# Altium project Brightside_Telemetry_rev2.PrjPcb (part 3 of 3)

## Sheet Brightside_Telemetry_stm_rev2.SchDoc
size A4
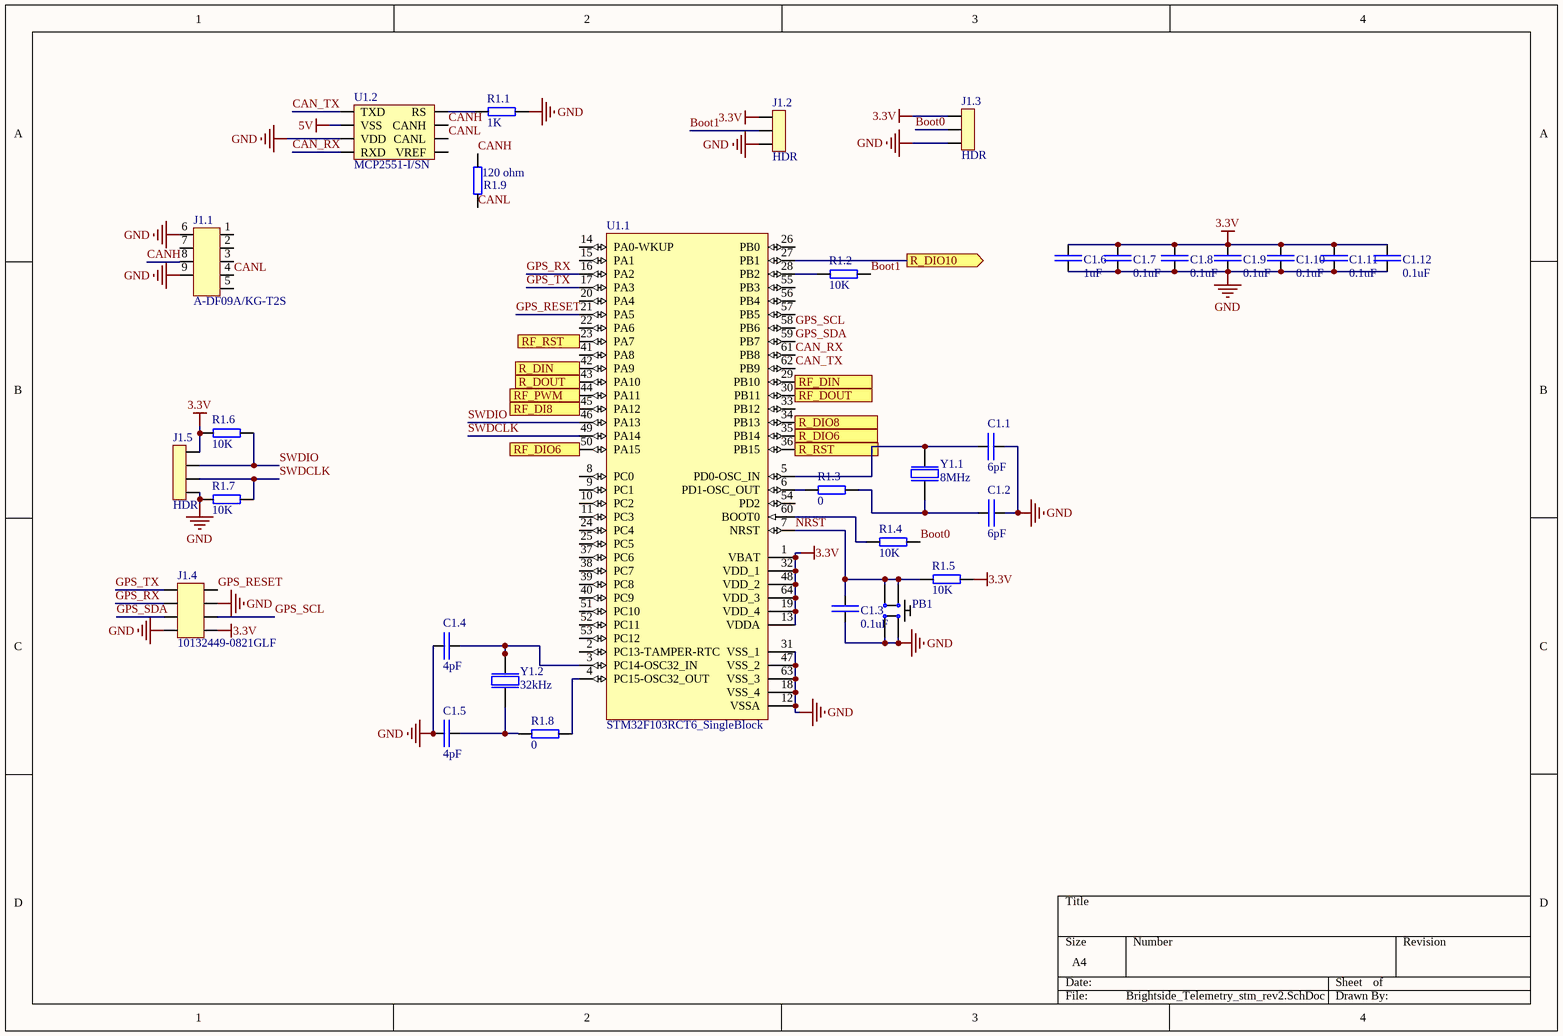
[diagram p2: Brightside_Telemetry_stm_rev2.SchDoc]

### Parts
C1.1  6pF  [0603]
C1.2  6pF  [0603]
C1.3  0.1uF  [C0805]
C1.4  4pF  [0603]
C1.5  4pF  [0603]
C1.6  1uF  [1206]
C1.7  0.1uF  [C0805]
C1.8  0.1uF  [C0805]
C1.9  0.1uF  [C0805]
C1.10  0.1uF  [C0805]
C1.11  0.1uF  [C0805]
C1.12  0.1uF  [C0805]
J1.1  A-DF09A/KG-T2S  [DB9 (Female)]
J1.2  HDR  [0.1" Header 3pos]
J1.3  HDR  [0.1" Header 3pos]
J1.4  10132449-0821GLF  [Micro-Fit 3.0 8pos]
J1.5  HDR  [0.1" Header 4pos]
PB1  P12961SCT-ND  [P12961SCT-ND]  (value not drawn)
R1.1  1K  [R0805]
R1.2  10K  [R0805]
R1.3  0  [0805]
R1.4  10K  [R0805]
R1.5  10K  [R0805]
R1.6  10K  [R0805]
R1.7  10K  [R0805]
R1.8  0  [0805]
R1.9  120 ohm  [R0805]
U1.1  STM32F103RCT6_SingleBlock  [64-LQFP]
U1.2  MCP2551-I/SN  [8-SOIC]
Y1.1  8MHz  [NX8045GB-8.000000MHZ]
Y1.2  32kHz  [FC-135 32.7680KA-AG]

### Ports
R_DIN (out), R_DIO6 (out), R_DIO8 (out), R_DIO10 (out), R_DOUT (out), R_RST (out), RF_DI8 (out), RF_DIN (out), RF_DIO6 (out), RF_DOUT (out), RF_PWM (out), RF_RST (out)

### Nets
3.3V: C1.6.1 C1.7.2 C1.8.2 C1.9.2 C1.10.2 C1.11.2 C1.12.2 J1.2.1 J1.3.1 J1.4.4 J1.5.4 R1.5.2 R1.6.1 U1.1.1(VBAT) U1.1.13(VDDA) U1.1.19(VDD_4) U1.1.32(VDD_1) U1.1.48(VDD_2) U1.1.64(VDD_3)
5V: U1.2.2(VSS)
GND: C1.1.2 C1.2.2 C1.3.1 C1.4.1 C1.5.1 C1.6.2 C1.7.1 C1.8.1 C1.9.1 C1.10.1 C1.11.1 C1.12.1 J1.1.6 J1.1.9 J1.2.3 J1.3.3 J1.4.2 J1.4.8 J1.5.1 PB1.2(A') PB1.4(B') R1.1.2 R1.7.1 U1.1.12(VSSA) U1.1.18(VSS_4) U1.1.31(VSS_1) U1.1.47(VSS_2) U1.1.63(VSS_3) U1.2.3(VDD)
Boot0: J1.3.2 R1.4.2
Boot1: J1.2.2 R1.2.2
CAN_RX: U1.1.61(PB8) U1.2.4(RXD)
CAN_TX: U1.1.62(PB9) U1.2.1(TXD)
CANH: J1.1.8 R1.9.2 U1.2.7(CANH)
CANL: J1.1.4 R1.9.1 U1.2.6(CANL)
GPS_RESET: J1.4.1 U1.1.21(PA5)
GPS_RX: J1.4.6 U1.1.16(PA2)
GPS_SCL: J1.4.3 U1.1.58(PB6)
GPS_SDA: J1.4.7 U1.1.59(PB7)
GPS_TX: J1.4.5 U1.1.17(PA3)
NRST: C1.3.2 PB1.1(A) PB1.3(B) R1.5.1 U1.1.7(NRST)
SWDCLK: J1.5.2 R1.7.2 U1.1.49(PA14)
SWDIO: J1.5.3 R1.6.2 U1.1.46(PA13)
NetC1.1_1: C1.1.1 U1.1.5(PD0-OSC_IN) Y1.1.2
NetC1.2_1: C1.2.1 R1.3.2 Y1.1.1
NetC1.4_2: C1.4.2 U1.1.3(PC14-OSC32_IN) Y1.2.1
NetC1.5_2: C1.5.2 R1.8.1 Y1.2.2
NetC2.12_1: U1.1.23(PA7) ; port RF_RST
NetC2.13_2: U1.1.36(PB15) ; port R_RST
NetR1.1_1: R1.1.1 U1.2.8(RS)
NetR1.2_1: R1.2.1 U1.1.28(PB2)
NetR1.3_1: R1.3.1 U1.1.6(PD1-OSC_OUT)
NetR1.4_1: R1.4.1 U1.1.60(BOOT0)
NetR1.8_2: R1.8.2 U1.1.4(PC15-OSC32_OUT)
NetR2.2_1: U1.1.42(PA9) ; port R_DIN
NetU1.1_27: U1.1.27(PB1) ; port R_DIO10
NetU1.1_29: U1.1.29(PB10) ; port RF_DIN
NetU1.1_30: U1.1.30(PB11) ; port RF_DOUT
NetU1.1_34: U1.1.34(PB13) ; port R_DIO8
NetU1.1_35: U1.1.35(PB14) ; port R_DIO6
NetU1.1_43: U1.1.43(PA10) ; port R_DOUT
NetU1.1_44: U1.1.44(PA11) ; port RF_PWM
NetU1.1_45: U1.1.45(PA12) ; port RF_DI8
NetU1.1_50: U1.1.50(PA15) ; port RF_DIO6

Not connected (* = marked no-connect by the designer): J1.1 1 2 3 5 7; U1.1 2(PC13-TAMPER-RTC) 8(PC0) 9(PC1) 10(PC2) 11(PC3) 14(PA0-WKUP) 15(PA1) 20(PA4) 22(PA6) 24(PC4) 25(PC5) 26(PB0) 33(PB12) 37(PC6) 38(PC7) 39(PC8) 40(PC9) 41(PA8) 51(PC10) 52(PC11) 53(PC12) 54(PD2) 55(PB3) 56(PB4) 57(PB5); U1.2 5(VREF)

### Library data of the parts
C1.1 C1.2 = CC0603DRNPO9BN6R0: CAP CER 6PF 50V C0G/NPO 0603; Manufacturer: Yageo; Dielectric: C0G; Supplier 1: Digi-Key; Supplier Part Number 1: 311-1055-1-ND; Manufacturer Part Number: CC0603DRNPO9BN6R0; RoHS: Yes; Category: Ceramic Capacitors; Stock 1: 25117; Mount: Surface Mount; Case/Package: 0603; Weight: 7.1E-05oz; Case Code (Imperial): 0603; Case Code (Metric): 1608; Min Operating Temperature: -55°C; Max Operating Temperature: 125°C; Capacitance: 6pF; Packaging: Tape and Reel; Voltage Rating: 50V; Voltage Rating (DC): 50V; Package Quantity: 1; Termination: SMD/SMT; Composition: Ceramic; Length: 1.6mm; Width: 0.8mm; Thickness: 0.035inch; Depth: 0.8mm; Lead Free: Lead Free; ComponentLink1URL: https://datasheet.ciiva.com/145/mlccorderingcode-145158.pdf?src-supplier=Digi-Key; ComponentLink1Description: https://datasheet.ciiva.com/145/mlccorderingcode-145158.pdf?src-supplier=Digi-Key; ComponentLink2URL: https://datasheet.ciiva.com/145/mlccorderingcode-145159.pdf?src-supplier=Digi-Key; ComponentLink2Description: https://datasheet.ciiva.com/145/mlccorderingcode-145159.pdf?src-supplier=Digi-Key; ComponentLink3URL: https://datasheet.ciiva.com/145/mlccorderingcode-145160.pdf?src-supplier=Digi-Key; ComponentLink3Description: https://datasheet.ciiva.com/145/mlccorderingcode-145160.pdf?src-supplier=Digi-Key
C1.3 C1.7-C1.12 = CL21B104KBCWPNC: CAP CER 0.1UF 50V X7R 0805; Manufacturer: Samsung; Capacitance: 100nF; Tolerance: 10%; Supplier 1: Digi-Key; Supplier Part Number 1: 1276-6557-1-ND; Manufacturer Part Number: CL21B104KBCWPNC; Stock 1: 6545; Pricing 1: 1 = 0.10000, 10 = 0.06700, 100 = 0.02990, 500 = 0.02138, 1000 = 0.01680 (USD); RoHS: Yes; Mount: Surface Mount; Case/Package: 0805; Case Code (Metric): 2012; Case Code (Imperial): 0805; Min Operating Temperature: -55°C; Max Operating Temperature: 125°C; Packaging: Tape and Reel; Voltage Rating: 50V; Features: Soft Termination; Length: 0.079inch; Width: 0.049inch; Thickness: 0.053inch; Ratings: AEC-Q200; Category: Capacitors
C1.4 C1.5 = CC0603CRNPO9BN4R0: CAP CER 4PF 50V C0G/NPO 0603; Manufacturer: Yageo; Dielectric: C0G; Insulation Resistance: 10GR; Supplier 1: Digi-Key; Supplier Part Number 1: 311-1053-1-ND; Manufacturer Part Number: CC0603CRNPO9BN4R0; RoHS: Yes; Category: Ceramic Capacitors; Stock 1: 1954; Mount: Surface Mount; Case/Package: 0603; Number of Pins: 2; Weight: 7.1E-05oz; Case Code (Imperial): 0603; Case Code (Metric): 1608; Min Operating Temperature: -55°C; Max Operating Temperature: 125°C; Termination: SMD/SMT; Composition: Ceramic; Capacitance: 4pF; Packaging: Tape and Reel; Voltage Rating: 50V; Voltage Rating (DC): 50V; Package Quantity: 1; Length: 1.6mm; Thickness: 0.035inch; Depth: 0.8mm; Width: 0.8mm; Lead Free: Lead Free; ComponentLink1URL: https://datasheet.ciiva.com/145/mlccorderingcode-145161.pdf?src-supplier=Digi-Key; ComponentLink1Description: https://datasheet.ciiva.com/145/mlccorderingcode-145161.pdf?src-supplier=Digi-Key; ComponentLink2URL: https://datasheet.ciiva.com/145/mlccorderingcode-145162.pdf?src-supplier=Digi-Key; ComponentLink2Description: https://datasheet.ciiva.com/145/mlccorderingcode-145162.pdf?src-supplier=Digi-Key; ComponentLink3URL: https://datasheet.ciiva.com/145/mlccorderingcode-145163.pdf?src-supplier=Digi-Key; ComponentLink3Description: https://datasheet.ciiva.com/145/mlccorderingcode-145163.pdf?src-supplier=Digi-Key
C1.6 = 885012208036: CAP CER 1UF 16V X7R 1206; Manufacturer: Wurth Electronics; Tolerance: 10%; Supplier 1: Digi-Key; Supplier Part Number 1: 732-7692-1-ND; Manufacturer Part Number: 885012208036; RoHS: Yes; Category: Ceramic Capacitors; Stock 1: 2993; Mount: Surface Mount; Case/Package: 1206; Case Code (Imperial): 1206; Case Code (Metric): 3216; Min Operating Temperature: -55°C; Max Operating Temperature: 125°C; Packaging: Tape and Reel; Capacitance: 1uF; Voltage Rating: 16V; Length: 0.126inch; Width: 0.063inch; Thickness: 0.051inch; ComponentLink1URL: http://katalog.we-online.de/pbs/datasheet/885012208036.pdf?src-supplier=Digi-Key; ComponentLink1Description: http://katalog.we-online.de/pbs/datasheet/885012208036.pdf?src-supplier=Digi-Key; ComponentLink2URL: https://katalog.we-online.de/pbs/datasheet/885012208036.pdf?src-supplier=Digi-Key; ComponentLink2Description: https://katalog.we-online.de/pbs/datasheet/885012208036.pdf?src-supplier=Digi-Key
J1.1 = A-DF09A/KG-T2S: FEMALE DB9 D-SUBMINIATURE CONNECTOR, CURRENT RATING 3A, VOLTAGE RATING 250VAC; Manufacturer: Assmann; Connector Type: D-Sub,Receptacle,Signal; Number of Positions: 9; Max Supply Voltage (AC): 250V; Number of Ports: 1; Supplier 1: Digi-Key; Supplier Part Number 1: AE10921-ND; Manufacturer Part Number: A-DF09A/KG-T2S; RoHS: Yes; Category: D-Sub Connectors; Stock 1: 18258; Mount: Through Hole; Housing Material: PBT; Color: Black; Contact Plating: Gold; Contact Material: Brass; Number of Terminals: 9; Min Operating Temperature: -55°C; Max Operating Temperature: 125°C; Package Quantity: 90; Packaging: Tray; Number of Rows: 2; Current Rating: 3A; Termination: Solder; Orientation: Right Angle; Length: 30.81mm; Depth: 18.6mm; Radiation Hardening: No; Lead Free: Lead Free; ComponentLink1URL: https://datasheet.ciiva.com/26927/getdatasheetpartid-755627-26927441.pdf?src-supplier=Verical; ComponentLink1Description: https://datasheet.ciiva.com/26927/getdatasheetpartid-755627-26927441.pdf?src-supplier=Verical
J1.2 J1.3 = 0.1" Header 3pos
J1.4 = 10132449-0821GLF: Micro-fit 3.0 8pos right-angle; Manufacturer: Molex; Manufacturer Part Number: 43045-0800; Number of Positions: 8; Contact Resistance: 10mR; Gender: Male; Working Voltage: 250V; Max Voltage Rating (DC): 250.25kV; Current Rating: 5A; Voltage Rating: 600V; Insulation Resistance: 1GR; Pitch: 3mm; Approvals: UL,CSA,TUV; Glow Wire Compliant: Compliant; Supplier 1: Digi-Key; Supplier Part Number 1: WM1816-ND; RoHS: Yes; Category: Headers and Wire Housings; Stock 1: 7880; Mount: Through Hole; Case/Package: SMC; Housing Color: Black; Housing Material: Thermoplastic; Contact Plating: Tin; Contact Material: Brass,Tin; Color: Black; Material: Polyester; Min Operating Temperature: -40°C; Max Operating Temperature: 105°C; Termination: Solder; Number of Contacts: 8; Orientation: Right Angle; Number of Rows: 2; Packaging: Tray; Number of Circuits: 8; Number of Poles: 8; Voltage Rating (AC): 250V; Package Quantity: 1440; Max Current Rating: 5A; Voltage Rating (DC): 250V; Diameter: 3mm; Length: 16.15mm; Height: 8.77mm; Row Spacing: 3mm; Depth: 12.2mm; Radiation Hardening: No; Flammability Rating: UL94 V-0; REACH SVHC: Unknown; Halogen Free: Low Halogen; Lead Free: Lead Free; ComponentLink1URL: https://datasheet.ciiva.com/5158/0430450800-pcb-headers-142625-5158817.pdf?src-supplier=Mouser; ComponentLink1Description: https://datasheet.ciiva.com/5158/0430450800-pcb-headers-142625-5158817.pdf?src-supplier=Mouser; ComponentLink2URL: https://datasheet.ciiva.com/7683/27645-7683683.pdf?src-supplier=Element14; ComponentLink2Description: https://datasheet.ciiva.com/7683/27645-7683683.pdf?src-supplier=Element14; ComponentLink3URL: https://datasheet.ciiva.com/11751/0900766b80027348-11751142.pdf?src-supplier=RSComponents; ComponentLink3Description: https://datasheet.ciiva.com/11751/0900766b80027348-11751142.pdf?src-supplier=RSComponents; ComponentLink4URL: https://datasheet.ciiva.com/30198/267770430450800-pcb-headers-30198875.pdf?src-supplier=Onlinecomponents.com; ComponentLink4Description: https://datasheet.ciiva.com/30198/267770430450800-pcb-headers-30198875.pdf?src-supplier=Onlinecomponents.com; ComponentLink5URL: https://datasheet.ciiva.com/19462/883536-19462164.pdf?src-supplier=Jameco; ComponentLink5Description: https://datasheet.ciiva.com/19462/883536-19462164.pdf?src-supplier=Jameco; ComponentLink6URL: https://datasheet.ciiva.com/14155/04402310-14155206.pdf?src-supplier=Distrelec; ComponentLink6Description: https://datasheet.ciiva.com/14155/04402310-14155206.pdf?src-supplier=Distrelec; ComponentLink7URL: https://datasheet.ciiva.com/16657/0430450800-pcb-headers-16657964.pdf?src-supplier=Avnet+Europe; ComponentLink7Description: https://datasheet.ciiva.com/16657/0430450800-pcb-headers-16657964.pdf?src-supplier=Avnet+Europe; ComponentLink8URL: https://datasheet.ciiva.com/10087/0430450800-pcb-headers-10087853.pdf?src-supplier=Avnet; ComponentLink8Description: https://datasheet.ciiva.com/10087/0430450800-pcb-headers-10087853.pdf?src-supplier=Avnet; ComponentLink9URL: https://datasheet.ciiva.com/1443/1850016-1443537.pdf?src-supplier=Element14; ComponentLink9Description: https://datasheet.ciiva.com/1443/1850016-1443537.pdf?src-supplier=Element14
J1.5 = 0.1" Header 4pos
PB1 = P12961SCT-ND: SWITCH TACTILE SPST-NO 0.02A 15V; Manufacturer 1: Panasonic; Manufacturer Part Number 1: EVQ-Q2Y03W; Mechanical Life: 100000Cycles; Operating Force: 3.5N; Contact Current Rating: 20mA; Contact Resistance: 100mR; Number of Poles: 1; Voltage Rating (AC): 250V; Throw Configuration: SPST; Illumination Type: Non-Illuminated,Illuminated; Switch Travel: 0.25mm; Switch Function: Off-Mom; Actuator Type: Standard; Actuator Length: 1.3mm; Supplier 1: Digi-Key; Stock 1: 209620; Pricing 1: 1=0.30000, 10=0.28600, 25=0.27520, 50=0.26520, 100=0.25490, 250=0.23452, 500=0.20394, 1000=0.17335 (USD); RoHS: Yes; Mount: Surface Mount; Case/Package: SMD/SMT; Color: White; Min Operating Temperature: -40°C; Max Operating Temperature: 85°C; Current Rating: 20mA; Voltage Rating (DC): 15V; Packaging: Tape and Reel; Package Quantity: 1; Max Current Rating: 20mA; Max Voltage Rating (DC): 15V; Termination: SMD/SMT; Electrical Life: 100000Cycles; Orientation: Straight; Length: 6mm; Height: 3.1mm; Width: 6mm; Depth: 6.6mm; Thickness: 1.8mm; Radiation Hardening: No; REACH SVHC: Unknown; Lead Free: Lead Free; ComponentLink1URL: https://datasheet.ciiva.com/25603/0900766b810ad3e5-25603840.pdf?src-supplier=RSComponents; ComponentLink1Description: https://datasheet.ciiva.com/25603/0900766b810ad3e5-25603840.pdf?src-supplier=RSComponents; ComponentLink2URL: https://datasheet.ciiva.com/2901/atk0000ce28-2901284.pdf?src-supplier=Digi-Key; ComponentLink2Description: https://datasheet.ciiva.com/2901/atk0000ce28-2901284.pdf?src-supplier=Digi-Key; ComponentLink3URL: https://datasheet.ciiva.com/2901/atk0000ce28-2901285.pdf?src-supplier=Digi-Key; ComponentLink3Description: https://datasheet.ciiva.com/2901/atk0000ce28-2901285.pdf?src-supplier=Digi-Key; ComponentLink4URL: https://datasheet.ciiva.com/2901/atk0000ce28-2901286.pdf?src-supplier=Digi-Key; ComponentLink4Description: https://datasheet.ciiva.com/2901/atk0000ce28-2901286.pdf?src-supplier=Digi-Key; ComponentLink5URL: https://datasheet.ciiva.com/30127/8atk0000ce28-30127814.pdf?src-supplier=Onlinecomponents.com; ComponentLink5Description: https://datasheet.ciiva.com/30127/8atk0000ce28-30127814.pdf?src-supplier=Onlinecomponents.com; ComponentLink6URL: https://datasheet.ciiva.com/8165/atk0000ce28-8165191.pdf?src-supplier=Avnet; ComponentLink6Description: https://datasheet.ciiva.com/8165/atk0000ce28-8165191.pdf?src-supplier=Avnet; ComponentLink7URL: https://datasheet.ciiva.com/17099/70270561-17099386.pdf?src-supplier=Allied+Electronics; ComponentLink7Description: https://datasheet.ciiva.com/17099/70270561-17099386.pdf?src-supplier=Allied+Electronics; ComponentLink8URL: https://datasheet.ciiva.com/5685/28111-5685339.pdf?src-supplier=Farnell; ComponentLink8Description: https://datasheet.ciiva.com/5685/28111-5685339.pdf?src-supplier=Farnell; ComponentLink9URL: https://datasheet.ciiva.com/16438/atk0000ce28-16438079.pdf?src-supplier=Future+Electronics; ComponentLink9Description: https://datasheet.ciiva.com/16438/atk0000ce28-16438079.pdf?src-supplier=Future+Electronics; Supplier Part Number 1: P12961SDKR-ND
R1.1 = ERJ6ENF1001V: RES SMD 1K OHM 1% 1/8W 0805; Manufacturer: Panasonic; Resistance: 1kR; Power Rating: 125mW; Temperature Coefficient: 100ppm/°C; Voltage Rating (DC): 150V; Supplier 1: Digi-Key; Supplier Part Number 1: P1.00KCCT-ND; Manufacturer Part Number: ERJ6ENF1001V; Stock 1: 946321; Pricing 1: 1 = 0.100000, 10 = 0.081000, 100 = 0.031100, 1000 = 0.013670, 2500 = 0.011810 (USD); RoHS: Yes; Mount: Surface Mount; Case/Package: 0805; Number of Pins: 2; Case Code (Metric): 2012; Case Code (Imperial): 0805; Contact Plating: Tin; Min Operating Temperature: -55°C; Max Operating Temperature: 155°C; Tolerance: 1%; Packaging: Tape and Reel; Number of Terminations: 2; Package Quantity: 1; Voltage Rating: 150V; Composition: Thick Film; Termination: SMD/SMT; Military Standard: Not; Max Power Dissipation: 125mW; Features: Automotive AEC-Q200; Length: 2mm; Height: 0.6mm; Width: 0.049inch; Depth: 1.25mm; Radiation Hardening: No; REACH SVHC: No SVHC; Lead Free: Lead Free; ComponentLink1URL: https://datasheet.ciiva.com/34303/1988962-34303619.pdf?src-supplier=Jameco; ComponentLink1Description: https://datasheet.ciiva.com/34303/1988962-34303619.pdf?src-supplier=Jameco; ComponentLink2URL: https://datasheet.ciiva.com/11808/0900766b80f80784-11808500.pdf?src-supplier=RSComponents; ComponentLink2Description: https://datasheet.ciiva.com/11808/0900766b80f80784-11808500.pdf?src-supplier=RSComponents; ComponentLink3URL: https://datasheet.ciiva.com/28532/426256-28532134.pdf?src-supplier=Element14; ComponentLink3Description: https://datasheet.ciiva.com/28532/426256-28532134.pdf?src-supplier=Element14; ComponentLink4URL: https://datasheet.ciiva.com/30051/aoa0000ce2-30051974.pdf?src-supplier=Onlinecomponents.com; ComponentLink4Description: https://datasheet.ciiva.com/30051/aoa0000ce2-30051974.pdf?src-supplier=Onlinecomponents.com; ComponentLink5URL: https://datasheet.ciiva.com/16774/70260748-16774249.pdf?src-supplier=Allied+Electronics; ComponentLink5Description: https://datasheet.ciiva.com/16774/70260748-16774249.pdf?src-supplier=Allied+Electronics; ComponentLink6URL: https://datasheet.ciiva.com/46373/1678782-46373337.pdf?src-supplier=Element14; ComponentLink6Description: https://datasheet.ciiva.com/46373/1678782-46373337.pdf?src-supplier=Element14; ComponentLink7URL: https://datasheet.ciiva.com/46373/1678782-46373338.pdf?src-supplier=Element14; ComponentLink7Description: https://datasheet.ciiva.com/46373/1678782-46373338.pdf?src-supplier=Element14; ComponentLink8URL: https://datasheet.ciiva.com/48532/aoa0000ce2-48532156.pdf?src-supplier=Avnet; ComponentLink8Description: https://datasheet.ciiva.com/48532/aoa0000ce2-48532156.pdf?src-supplier=Avnet; ComponentLink9URL: https://datasheet.ciiva.com/7942/426256-7942429.pdf?src-supplier=Element14; ComponentLink9Description: https://datasheet.ciiva.com/7942/426256-7942429.pdf?src-supplier=Element14; ComponentLink10URL: https://datasheet.ciiva.com/16199/aoa0000ce2-16199262.pdf?src-supplier=Future+Electronics; ComponentLink10Description: https://datasheet.ciiva.com/16199/aoa0000ce2-16199262.pdf?src-supplier=Future+Electronics; ComponentLink11URL: https://datasheet.ciiva.com/9117/aoa0000ce2-9117391.pdf?src-supplier=Avnet; ComponentLink11Description: https://datasheet.ciiva.com/9117/aoa0000ce2-9117391.pdf?src-supplier=Avnet; ComponentLink12URL: https://datasheet.ciiva.com/16523/aoa0000ce2-16523855.pdf?src-supplier=Avnet+Asia; ComponentLink12Description: https://datasheet.ciiva.com/16523/aoa0000ce2-16523855.pdf?src-supplier=Avnet+Asia; Category: Resistors
R1.2 R1.4-R1.7 = ERJ6ENF1002V: RES SMD 10K OHM 1% 1/8W 0805; Manufacturer: Yageo; Manufacturer Part Number: ERJ-6ENF1002V; Temperature Coefficient: 100ppm/°C; Voltage Rating (DC): 150V; Power Rating: 125mW; Resistance: 10000R; Supplier 1: Digi-Key; Supplier Part Number 1: P10.0KCCT-ND; Stock 1: 3342401; Pricing 1: 1 = 0.100000, 10 = 0.081000, 100 = 0.031100, 1000 = 0.013670, 2500 = 0.011810 (USD); RoHS: No; Mount: Surface Mount; Case/Package: 0805; Number of Pins: 2; Min Operating Temperature: -55°C; Max Operating Temperature: 155°C; Packaging: Tape and Reel; Tolerance: 1%; Length: 2mm; Height: 0.5mm; Depth: 1.25mm; Width: 1.25mm; REACH SVHC: No SVHC; Lead Free: Lead Free; ComponentLink1URL: https://datasheet.ciiva.com/27056/2078477-27056611.pdf?src-supplier=Jameco; ComponentLink1Description: https://datasheet.ciiva.com/27056/2078477-27056611.pdf?src-supplier=Jameco; Category: Resistors
R1.3 R1.8 = RMCF0805ZT0R00: STACKPOLE ELECTRONICS - RMCF0805ZT0R00. - RES THKFLM 0805 0 OHM JUMPER 1/8W 200PPM/ C SMD ROHS COMPLIANT: YES; Resistance: 0mR; Power Rating: 125mW; Supplier 1: Digi-Key; Supplier Part Number 1: RMCF0805ZT0R00CT-ND; Manufacturer: Stackpole Electronics; Manufacturer Part Number: RMCF0805ZT0R00; RoHS: Yes; Category: Chip SMD Resistors; Stock 1: 14305; Mount: Surface Mount; Case/Package: 0805; Case Code (Metric): 2012; Case Code (Imperial): 0805; Contact Plating: Tin,Matte; Min Operating Temperature: -55°C; Max Operating Temperature: 155°C; Packaging: Tape and Reel; Features: Automotive AEC-Q200; Composition: Thick Film; Number of Terminations: 2; Military Standard: Not; Max Power Dissipation: 125mW; Length: 2mm; Height: 0.026inch; Width: 0.049inch; Depth: 1.25mm; Radiation Hardening: No; Lead Free: Lead Free; ComponentLink1URL: https://datasheet.ciiva.com/15193/getdatasheetpartid-360417-15193658.pdf?src-supplier=Verical; ComponentLink1Description: https://datasheet.ciiva.com/15193/getdatasheetpartid-360417-15193658.pdf?src-supplier=Verical
R1.9 = ERJ6ENV1200V: RES SMD 120 OHM 1% 1/8W 0805; ComponentLink1Description: https://datasheet.ciiva.com/11821/0900766b80f80784-11821533.pdf?src-supplier=RSComponents; ComponentLink1URL: https://datasheet.ciiva.com/11821/0900766b80f80784-11821533.pdf?src-supplier=RSComponents; Supplier 1: Digi-Key; Supplier Part Number 1: P120CCT-ND
U1.1 = STM32F103RCT6_SingleBlock: ARM® Cortex®-M3 STM32F1 Microcontroller IC 32-Bit 72MHz 256KB (256K x 8) FLASH; Supplier 1: Digi-Key; Supplier Part Number 1: 497-8920-ND
U1.2 = MCP2551-I/SN: CAN TRANSCEIVER; Manufacturer: Microchip; Body Material: Steel; Number of Contacts: 9; Current Rating: 5A; Gender: Male; Connector Type: D-Sub,Plug,Signal; Voltage Rating: 125V; Pitch: 2.84mm; Max Supply Voltage: 5.5V; Min Supply Voltage: 2.7V; Interface: SPI; Max Frequency: 400kHz; Access Time: 900ns; Density: 256Kb; Operating Supply Voltage: 5V; Frequency: 1MHz; Nominal Supply Current: 2.5mA; Memory Type: EEPROM; Contact Resistance: 10mR; Voltage Rating (AC): 250V; Number of Circuits: 2; Insulation Resistance: 1GR; Glow Wire Compliant: Compliant; Row Spacing: 0.1inch; Frequency Stability: 30ppm; Load Capacitance: 18pF; ESR (Equivalent Series Resistance): 140R; Frequency Tolerance: 20ppm; Series Resistance: 500R; Supplier 1: Digi-Key; Supplier Part Number 1: MCP2551-I/SN-ND; Manufacturer Part Number: MCP2551-I/SN; RoHS: Yes; Category: Interface ICs; Stock 1: 3363; ComponentLink1URL: https://datasheet.ciiva.com/8084/jp011797-8084592.pdf?src-supplier=Avnet; ComponentLink1Description: https://datasheet.ciiva.com/8084/jp011797-8084592.pdf?src-supplier=Avnet; ComponentLink2URL: https://datasheet.ciiva.com/27056/2040583-27056423.pdf?src-supplier=Jameco; ComponentLink2Description: https://datasheet.ciiva.com/27056/2040583-27056423.pdf?src-supplier=Jameco; ComponentLink3URL: https://datasheet.ciiva.com/1495/21667f-1495089.pdf?src-supplier=Element14; ComponentLink3Description: https://datasheet.ciiva.com/1495/21667f-1495089.pdf?src-supplier=Element14; ComponentLink4URL: https://datasheet.ciiva.com/1700/21667f-1700023.pdf?src-supplier=Digi-Key; ComponentLink4Description: https://datasheet.ciiva.com/1700/21667f-1700023.pdf?src-supplier=Digi-Key; ComponentLink5URL: https://datasheet.ciiva.com/14152/eb644223-644224-e-14152540.pdf?src-supplier=Distrelec; ComponentLink5Description: https://datasheet.ciiva.com/14152/eb644223-644224-e-14152540.pdf?src-supplier=Distrelec; ComponentLink6URL: https://datasheet.ciiva.com/17649/jp011797-17649039.pdf?src-supplier=Avnet+Europe; ComponentLink6Description: https://datasheet.ciiva.com/17649/jp011797-17649039.pdf?src-supplier=Avnet+Europe; Supplier 2: Digi-Key; Supplier Part Number 2: 9209ME-ND; Stock 2: 10320; Mount: Through Hole; Contact Plating: Gold; Contact Material: Brass; Housing Material: Nylon; Color: Black; Material: Metal; Housing Color: Black; Min Operating Temperature: -50°C; Max Operating Temperature: 100°C; Package Quantity: 80; Packaging: Tray; Termination: Through Hole; Number of Rows: 2; Number of Positions: 9; Length: 30.8mm; Height: 9.93mm; Width: 12.6mm; REACH SVHC: No SVHC; Lead Free: Lead Free; Flammability Rating: UL94 V-0; ComponentLink7URL: https://datasheet.ciiva.com/655/171-yyy-113ryy1-655574.pdf?src-supplier=Digi-Key; ComponentLink7Description: https://datasheet.ciiva.com/655/171-yyy-113ryy1-655574.pdf?src-supplier=Digi-Key; ComponentLink8URL: https://datasheet.ciiva.com/5118/171-yyy-113ryy1-5118968.pdf?src-supplier=Mouser; ComponentLink8Description: https://datasheet.ciiva.com/5118/171-yyy-113ryy1-5118968.pdf?src-supplier=Mouser; ComponentLink9URL: https://datasheet.ciiva.com/16376/171-yyy-113ryy1-16376504.pdf?src-supplier=Future+Electronics; ComponentLink9Description: https://datasheet.ciiva.com/16376/171-yyy-113ryy1-16376504.pdf?src-supplier=Future+Electronics; Supplier 3: Digi-Key; Supplier Part Number 3: 732-618009231121-ND; Stock 3: 281; Orientation: Right Angle; Depth: 18.5mm; ComponentLink10URL: https://datasheet.ciiva.com/12669/6180xx231121-12669218.pdf?src-supplier=Mouser; ComponentLink10Description: https://datasheet.ciiva.com/12669/6180xx231121-12669218.pdf?src-supplier=Mouser; ComponentLink11URL: https://datasheet.ciiva.com/1426/1442189-1426428.pdf?src-supplier=Element14; ComponentLink11Description: https://datasheet.ciiva.com/1426/1442189-1426428.pdf?src-supplier=Element14; Supplier 4: Digi-Key; Supplier Part Number 4: 732-618009231221-ND; Stock 4: 49; ComponentLink12URL: https://datasheet.ciiva.com/12669/6180xx231221-12669204.pdf?src-supplier=Mouser; ComponentLink12Description: https://datasheet.ciiva.com/12669/6180xx231221-12669204.pdf?src-supplier=Mouser; ComponentLink13URL: https://datasheet.ciiva.com/25605/0900766b81191766-25605476.pdf?src-supplier=RSComponents; ComponentLink13Description: https://datasheet.ciiva.com/25605/0900766b81191766-25605476.pdf?src-supplier=RSComponents; ComponentLink14URL: https://datasheet.ciiva.com/1426/1442191-1426429.pdf?src-supplier=Element14; ComponentLink14Description: https://datasheet.ciiva.com/1426/1442191-1426429.pdf?src-supplier=Element14; Supplier 5: Digi-Key; Supplier Part Number 5: LTC6820IMS#PBF-ND; Stock 5: 4671; Case/Package: MSOP; Number of Pins: 16; ComponentLink15URL: https://datasheet.ciiva.com/22649/1730562-22649446.pdf?src-supplier=Element14; ComponentLink15Description: https://datasheet.ciiva.com/22649/1730562-22649446.pdf?src-supplier=Element14; ComponentLink16URL: https://datasheet.ciiva.com/22767/1730562-22767677.pdf?src-supplier=Farnell; ComponentLink16Description: https://datasheet.ciiva.com/22767/1730562-22767677.pdf?src-supplier=Farnell; Supplier 6: Digi-Key; Supplier Part Number 6: 497-6348-1-ND; Stock 6: 4627; Memory Size: 256Kb; Radiation Hardening: No; ComponentLink17URL: https://datasheet.ciiva.com/15123/getdatasheetpartid-309492-15123357.pdf?src-supplier=Verical; ComponentLink17Description: https://datasheet.ciiva.com/15123/getdatasheetpartid-309492-15123357.pdf?src-supplier=Verical; ComponentLink18URL: https://datasheet.ciiva.com/41455/001185584-da-01-en-ic-eepr-256kbi-m24256-brmn6tp-soic-8-stm-41455201.pdf?src-supplier=Conrad; ComponentLink18Description: https://datasheet.ciiva.com/41455/001185584-da-01-en-ic-eepr-256kbi-m24256-brmn6tp-soic-8-stm-41455201.pdf?src-supplier=Conrad; ComponentLink19URL: https://datasheet.ciiva.com/1905/cd00001891-1905179.pdf?src-supplier=Digi-Key; ComponentLink19Description: https://datasheet.ciiva.com/1905/cd00001891-1905179.pdf?src-supplier=Digi-Key; ComponentLink20URL: https://datasheet.ciiva.com/1905/cd00001891-1905180.pdf?src-supplier=Digi-Key; ComponentLink20Description: https://datasheet.ciiva.com/1905/cd00001891-1905180.pdf?src-supplier=Digi-Key; ComponentLink21URL: https://datasheet.ciiva.com/1905/cd00001891-1905181.pdf?src-supplier=Digi-Key; ComponentLink21Description: https://datasheet.ciiva.com/1905/cd00001891-1905181.pdf?src-supplier=Digi-Key; Supplier 7: Digi-Key; Supplier Part Number 7: WM1860-ND; Stock 7: 11258; Working Voltage: 250V; Voltage Rating (DC): 250V; Halogen Free: Low Halogen; ComponentLink22URL: https://datasheet.ciiva.com/14155/04402066-14155224.pdf?src-supplier=Distrelec; ComponentLink22Description: https://datasheet.ciiva.com/14155/04402066-14155224.pdf?src-supplier=Distrelec; ComponentLink23URL: https://datasheet.ciiva.com/5158/0436500200-pcb-headers-148844-5158523.pdf?src-supplier=Mouser; ComponentLink23Description: https://datasheet.ciiva.com/5158/0436500200-pcb-headers-148844-5158523.pdf?src-supplier=Mouser; ComponentLink24URL: https://datasheet.ciiva.com/11748/0900766b80d6135b-11748140.pdf?src-supplier=RSComponents; ComponentLink24Description: https://datasheet.ciiva.com/11748/0900766b80d6135b-11748140.pdf?src-supplier=RSComponents; ComponentLink25URL: https://datasheet.ciiva.com/22683/1709823-22683551.pdf?src-supplier=Element14; ComponentLink25Description: https://datasheet.ciiva.com/22683/1709823-22683551.pdf?src-supplier=Element14; ComponentLink26URL: https://datasheet.ciiva.com/30161/48630436500200-pcb-headers-30161343.pdf?src-supplier=Onlinecomponents.com; ComponentLink26Description: https://datasheet.ciiva.com/30161/48630436500200-pcb-headers-30161343.pdf?src-supplier=Onlinecomponents.com; ComponentLink27URL: https://datasheet.ciiva.com/9432/0436500200-pcb-headers-9432849.pdf?src-supplier=Avnet; ComponentLink27Description: https://datasheet.ciiva.com/9432/0436500200-pcb-headers-9432849.pdf?src-supplier=Avnet; ComponentLink28URL: https://datasheet.ciiva.com/16089/1029720436500200-pcb-headers-16089218.pdf?src-supplier=Onlinecomponents.com; ComponentLink28Description: https://datasheet.ciiva.com/16089/1029720436500200-pcb-headers-16089218.pdf?src-supplier=Onlinecomponents.com; ComponentLink29URL: https://datasheet.ciiva.com/7920/1839562-7920756.pdf?src-supplier=Element14; ComponentLink29Description: https://datasheet.ciiva.com/7920/1839562-7920756.pdf?src-supplier=Element14; ComponentLink30URL: https://datasheet.ciiva.com/19462/884053-19462312.pdf?src-supplier=Jameco; ComponentLink30Description: https://datasheet.ciiva.com/19462/884053-19462312.pdf?src-supplier=Jameco; ComponentLink31URL: https://datasheet.ciiva.com/16654/0436500200-pcb-headers-16654958.pdf?src-supplier=Avnet+Europe; ComponentLink31Description: https://datasheet.ciiva.com/16654/0436500200-pcb-headers-16654958.pdf?src-supplier=Avnet+Europe; Supplier 8: Digi-Key; Supplier Part Number 8: 1175-1623-ND; Stock 8: 21730; ComponentLink32URL: https://datasheet.ciiva.com/6904/3020-34-0300-00-6904731.pdf?src-supplier=Digi-Key; ComponentLink32Description: https://datasheet.ciiva.com/6904/3020-34-0300-00-6904731.pdf?src-supplier=Digi-Key; ComponentLink33URL: https://datasheet.ciiva.com/18485/3020-xx-0300-00-18485471.pdf?src-supplier=Digi-Key; ComponentLink33Description: https://datasheet.ciiva.com/18485/3020-xx-0300-00-18485471.pdf?src-supplier=Digi-Key; Supplier 9: Digi-Key; Supplier Part Number 9: 535-10630-1-ND; Stock 9: 68218; Composition: Ceramic; Tolerance: 20ppm; ComponentLink34URL: https://datasheet.ciiva.com/862/abm3-862465.pdf?src-supplier=Digi-Key; ComponentLink34Description: https://datasheet.ciiva.com/862/abm3-862465.pdf?src-supplier=Digi-Key; Supplier 10: Digi-Key; Supplier Part Number 10: 535-9544-1-ND; Stock 10: 100673; ComponentLink35URL: https://datasheet.ciiva.com/855/abs07-855948.pdf?src-supplier=Digi-Key; ComponentLink35Description: https://datasheet.ciiva.com/855/abs07-855948.pdf?src-supplier=Digi-Key
Y1.1 = NX8045GB-8.000000MHZ: CRYSTAL 8.0000MHZ 8PF SMD; Manufacturer: NDK; ESR (Equivalent Series Resistance): 200R; Frequency Stability: 50ppm; Supplier 1: Digi-Key; Supplier Part Number 1: 644-1018-1-ND; Manufacturer Part Number: NX8045GB-8.000000MHZ; RoHS: Yes; Category: Crystals; Stock 1: 116457; Mount: Surface Mount; Case/Package: SMD/SMT; Number of Pins: 2; Min Operating Temperature: -10°C; Max Operating Temperature: 70°C; Packaging: Tape and Reel; Package Quantity: 1000; Frequency: 8MHz; Load Capacitance: 8pF; Frequency Tolerance: 50ppm; Length: 0.315inch; Height: 0.079inch; Width: 0.177inch; Lead Free: Exempt; ComponentLink1URL: https://datasheet.ciiva.com/856/nx8045gb-856752.pdf?src-supplier=Digi-Key; ComponentLink1Description: https://datasheet.ciiva.com/856/nx8045gb-856752.pdf?src-supplier=Digi-Key; ComponentLink2URL: https://datasheet.ciiva.com/856/nx8045gb-856753.pdf?src-supplier=Digi-Key; ComponentLink2Description: https://datasheet.ciiva.com/856/nx8045gb-856753.pdf?src-supplier=Digi-Key; ComponentLink3URL: https://datasheet.ciiva.com/856/nx8045gb-856754.pdf?src-supplier=Digi-Key; ComponentLink3Description: https://datasheet.ciiva.com/856/nx8045gb-856754.pdf?src-supplier=Digi-Key
Y1.2 = FC-13532.7680KA-AG0: Crystals 32.768KHz 20ppm 7.0pF -40C +85C; Manufacturer: Epson; Load Capacitance: 7pF; ESR (Equivalent Series Resistance): 65kR; Capacitance: 7E-12F; Supplier 1: Mouser; Supplier Part Number 1: 732-FC135-32.76KAAG0; Manufacturer Part Number: FC-13532.7680KA-AG0; RoHS: No; Category: Uncategorized; Weight: 0.000564oz; Min Operating Temperature: -40°C; Max Operating Temperature: 85°C; Frequency: 32.768kHz; Packaging: Tape and Reel; Tolerance: 20ppm; Package Quantity: 1000; Termination: SMD/SMT; Frequency Stability: 20ppm; Length: 3.2mm; Height: 0.8mm; Width: 1.5mm; ComponentLink1URL: http://www.mouser.com/ds/2/137/1699449-465441.pdf?src-supplier=Mouser; ComponentLink1Description: http://www.mouser.com/ds/2/137/1699449-465441.pdf?src-supplier=Mouser

## Sheet misc_comp.SchDoc
size A4
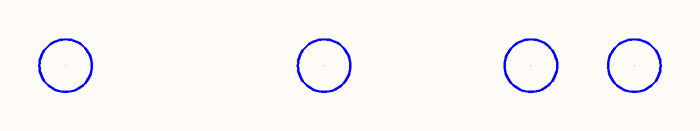
[diagram p3: misc_comp.SchDoc]

### Parts
M1  3mm Mounting Hole  [3mm Mounting Hole]  (value not drawn)
M2  3mm Mounting Hole  [3mm Mounting Hole]  (value not drawn)
M3  3mm Mounting Hole  [3mm Mounting Hole]  (value not drawn)
M4  3mm Mounting Hole  [3mm Mounting Hole]  (value not drawn)

### Nets

Not connected (* = marked no-connect by the designer): M1 1; M2 1; M3 1; M4 1

## Nets that join several sheets
3.3V: Brightside_Telemetry_power_rev2 (C0.5.2 D0.2.2 J0.3.1 L0.4.2), Brightside_Telemetry_RC_rev2 (18 pins), Brightside_Telemetry_stm_rev2 (19 pins)
5V: Brightside_Telemetry_power_rev2 (6 pins), Brightside_Telemetry_stm_rev2 (U1.2.2)
GND: Brightside_Telemetry_power_rev2 (41 pins), Brightside_Telemetry_RC_rev2 (25 pins), Brightside_Telemetry_stm_rev2 (29 pins)
NetC2.12_1: Brightside_Telemetry_RC_rev2 (C2.12.1 U2.2.5), Brightside_Telemetry_stm_rev2 (U1.1.23)
NetC2.13_2: Brightside_Telemetry_RC_rev2 (C2.13.2 U2.1.6), Brightside_Telemetry_stm_rev2 (U1.1.36)
NetR2.2_1: Brightside_Telemetry_RC_rev2 (R2.2.1), Brightside_Telemetry_stm_rev2 (U1.1.42)
NetU1.1_27: Brightside_Telemetry_RC_rev2 (U2.1.7), Brightside_Telemetry_stm_rev2 (U1.1.27)
NetU1.1_29: Brightside_Telemetry_RC_rev2 (U2.2.3), Brightside_Telemetry_stm_rev2 (U1.1.29)
NetU1.1_30: Brightside_Telemetry_RC_rev2 (U2.2.2), Brightside_Telemetry_stm_rev2 (U1.1.30)
NetU1.1_34: Brightside_Telemetry_RC_rev2 (U2.1.10), Brightside_Telemetry_stm_rev2 (U1.1.34)
NetU1.1_35: Brightside_Telemetry_RC_rev2 (U2.1.29), Brightside_Telemetry_stm_rev2 (U1.1.35)
NetU1.1_43: Brightside_Telemetry_RC_rev2 (U2.1.3), Brightside_Telemetry_stm_rev2 (U1.1.43)
NetU1.1_44: Brightside_Telemetry_RC_rev2 (U2.2.6), Brightside_Telemetry_stm_rev2 (U1.1.44)
NetU1.1_45: Brightside_Telemetry_RC_rev2 (U2.2.9), Brightside_Telemetry_stm_rev2 (U1.1.45)
NetU1.1_50: Brightside_Telemetry_RC_rev2 (U2.2.16), Brightside_Telemetry_stm_rev2 (U1.1.50)